# Altium schematic sheet EV9920.SchDoc: CMX992-Based Demodulator
size A2 portrait
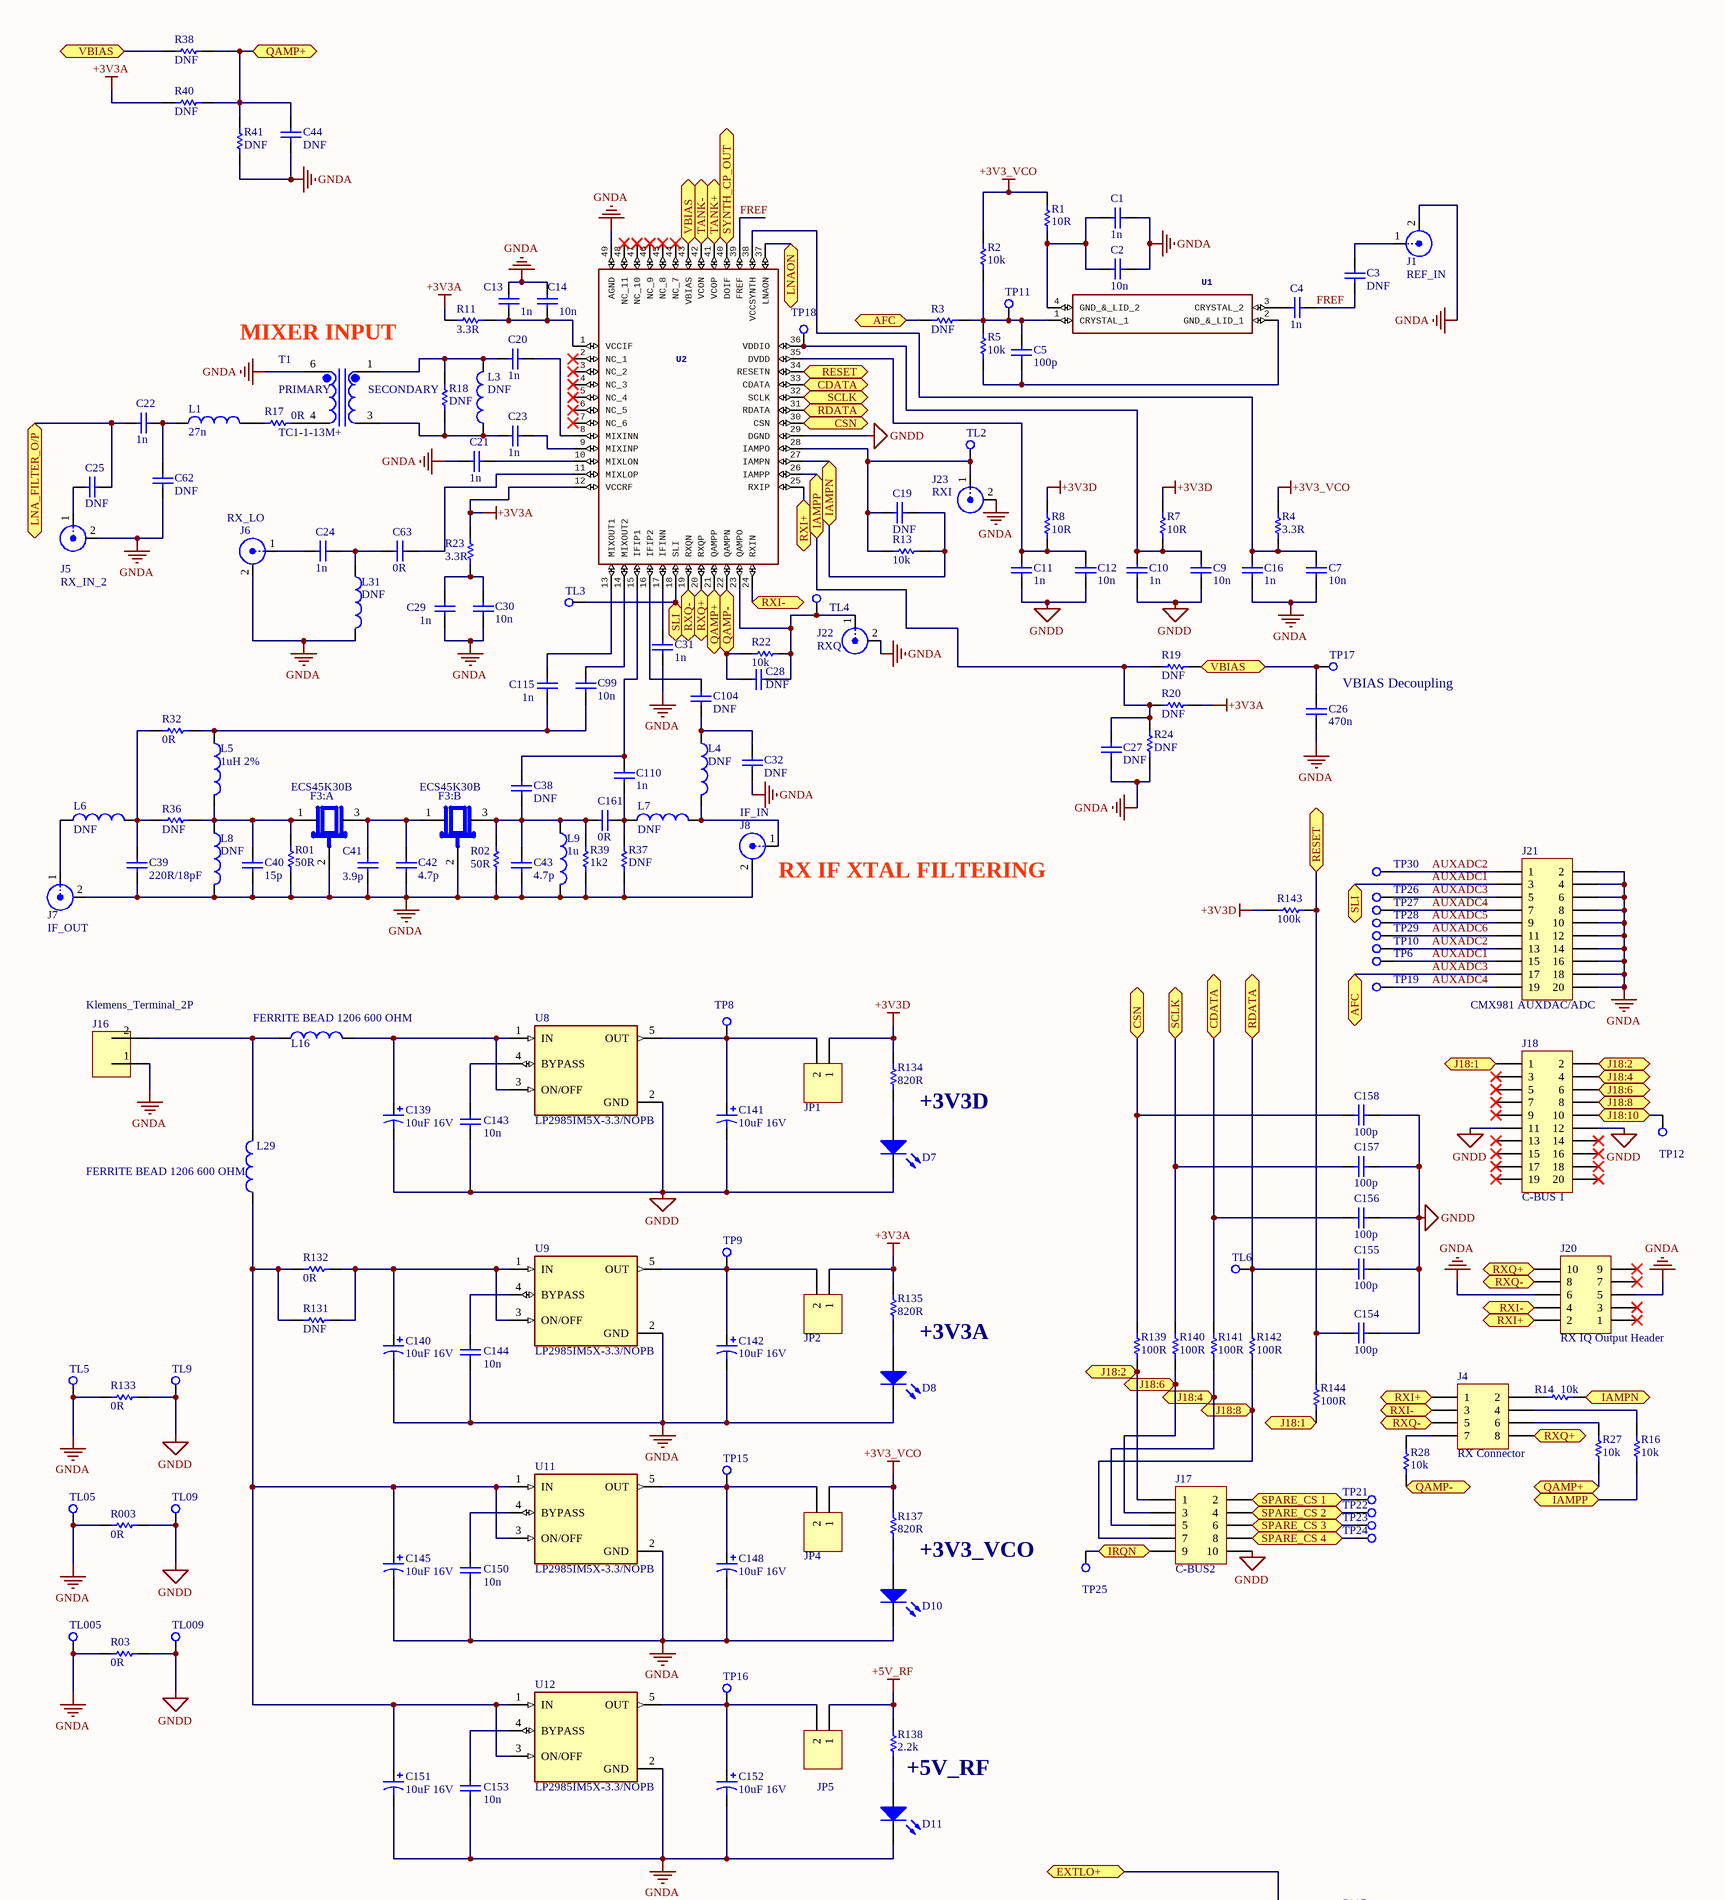
[diagram p0: EV9920.SchDoc, top]
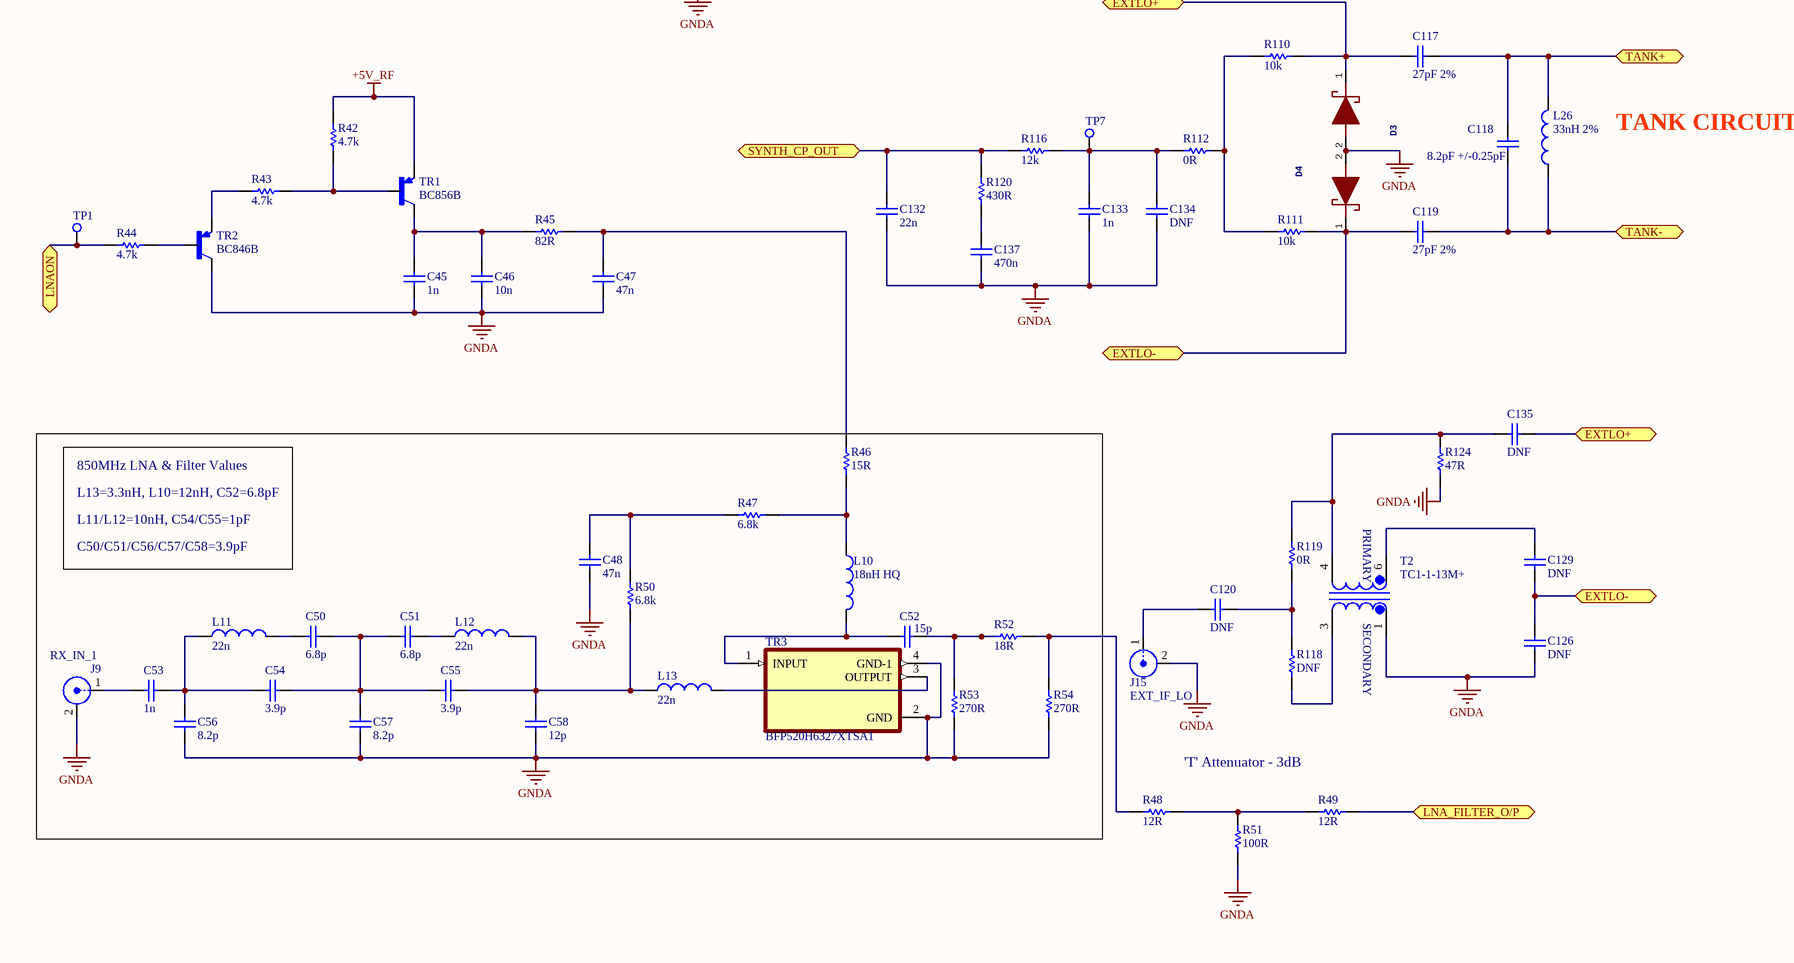
[diagram p1: EV9920.SchDoc, bottom]

## Parts
C1  value 1n  [0805]  (hidden comment: Cap_0805)
C2  value 10n  [0805]  (hidden comment: Cap_0805)
C3  value DNF  [0805]  (hidden comment: Cap_0805)
C4  value 1n  [0805]  (hidden comment: Cap_0805)
C5  value 100p  [0805]  (hidden comment: Cap_0805)
C7  value 10n  [0805]  (hidden comment: Cap_0805)
C9  value 10n  [0805]  (hidden comment: Cap_0805)
C10  value 1n  [0805]  (hidden comment: Cap_0805)
C11  value 1n  [0805]  (hidden comment: Cap_0805)
C12  value 10n  [0805]  (hidden comment: Cap_0805)
C13  value 1n  [0805]  (hidden comment: Cap_0805)
C14  value 10n  [0805]  (hidden comment: Cap_0805)
C16  value 1n  [0805]  (hidden comment: Cap_0805)
C19  value DNF  [0805]  (hidden comment: Cap_0805)
C20  value 1n  [0805]  (hidden comment: Cap_0805)
C21  value 1n  [0805]  (hidden comment: Cap_0805)
C22  value 1n  [0805]  (hidden comment: Cap_0805)
C23  value 1n  [0805]  (hidden comment: Cap_0805)
C24  value 1n  [0805]  (hidden comment: Cap_0805)
C25  value DNF  [0805]  (hidden comment: Cap_0805)
C26  value 470n  [0805]  (hidden comment: Cap_0805)
C27  value DNF  [0805]  (hidden comment: Cap_0805)
C28  value DNF  [0805]  (hidden comment: Cap_0805)
C29  value 1n  [0805]  (hidden comment: Cap_0805)
C30  value 10n  [0805]  (hidden comment: Cap_0805)
C31  value 1n  [0805]  (hidden comment: Cap_0805)
C32  value DNF  [0805]  (hidden comment: Cap_0805)
C38  value DNF  [0805]  (hidden comment: Cap_0805)
C39  value 220R/18pF  [0805]  (hidden comment: Cap_0805)
C40  value 15p  [0805]  (hidden comment: Cap_0805)
C41  value 3.9p  [0805]  (hidden comment: Cap_0805)
C42  value 4.7p  [0805]  (hidden comment: Cap_0805)
C43  value 4.7p  [0805]  (hidden comment: Cap_0805)
C44  value DNF  [0805]  (hidden comment: Cap_0805)
C45  value 1n  [0805]  (hidden comment: Cap_0805)
C46  value 10n  [0805]  (hidden comment: Cap_0805)
C47  value 47n  [0805]  (hidden comment: Cap_0805)
C48  value 47n  [0805]  (hidden comment: Cap_0805)
C50  value 6.8p  [0805]  (hidden comment: Cap_0805)
C51  value 6.8p  [0805]  (hidden comment: Cap_0805)
C52  value 15p  [0805]  (hidden comment: Cap_0805)
C53  value 1n  [0805]  (hidden comment: Cap_0805)
C54  value 3.9p  [0805]  (hidden comment: Cap_0805)
C55  value 3.9p  [0805]  (hidden comment: Cap_0805)
C56  value 8.2p  [0805]  (hidden comment: Cap_0805)
C57  value 8.2p  [0805]  (hidden comment: Cap_0805)
C58  value 12p  [0805]  (hidden comment: Cap_0805)
C62  value DNF  [0805]  (hidden comment: Cap_0805)
C63  value 0R  [0805]  (hidden comment: Cap_0805)
C99  value 10n  [0805]  (hidden comment: Cap_0805)
C104  value DNF  [0805]  (hidden comment: Cap_0805)
C110  value 1n  [0805]  (hidden comment: Cap_0805)
C115  value 1n  [0805]  (hidden comment: Cap_0805)
C117  value 27pF 2%  [0805]  (hidden comment: Cap_0805)
C118  value 8.2pF +/-0.25pF  [0805]  (hidden comment: Cap_0805)
C119  value 27pF 2%  [0805]  (hidden comment: Cap_0805)
C120  value DNF  [0805]  (hidden comment: Cap_0805)
C126  value DNF  [0805]  (hidden comment: Cap_0805)
C129  value DNF  [0805]  (hidden comment: Cap_0805)
C132  value 22n  [0805]  (hidden comment: Cap_0805)
C133  value 1n  [0805]  (hidden comment: Cap_0805)
C134  value DNF  [0805]  (hidden comment: Cap_0805)
C135  value DNF  [0805]  (hidden comment: Cap_0805)
C137  value 470n  [0805]  (hidden comment: Cap_0805)
C139  value 10uF 16V  [0805 - Directional]  (hidden comment: Cap Pol2)
C140  value 10uF 16V  [0805 - Directional]  (hidden comment: Cap Pol2)
C141  value 10uF 16V  [0805 - Directional]  (hidden comment: Cap Pol2)
C142  value 10uF 16V  [0805 - Directional]  (hidden comment: Cap Pol2)
C143  value 10n  [0805]  (hidden comment: Cap_0805)
C144  value 10n  [0805]  (hidden comment: Cap_0805)
C145  value 10uF 16V  [0805 - Directional]  (hidden comment: Cap Pol2)
C148  value 10uF 16V  [0805 - Directional]  (hidden comment: Cap Pol2)
C150  value 10n  [0805]  (hidden comment: Cap_0805)
C151  value 10uF 16V  [0805 - Directional]  (hidden comment: Cap Pol2)
C152  value 10uF 16V  [0805 - Directional]  (hidden comment: Cap Pol2)
C153  value 10n  [0805]  (hidden comment: Cap_0805)
C154  value 100p  [0805]  (hidden comment: Cap_0805)
C155  value 100p  [0805]  (hidden comment: Cap_0805)
C156  value 100p  [0805]  (hidden comment: Cap_0805)
C157  value 100p  [0805]  (hidden comment: Cap_0805)
C158  value 100p  [0805]  (hidden comment: Cap_0805)
C161  value 0R  [0805]  (hidden comment: Cap_0805)
D3  Small Signal Schottky Diode, Single, 20 V, 500 mA, 480 mV, 6 A, 125 C   Source:  Datasheet  [PMEG2005EB115]  (value not drawn)
D4  Small Signal Schottky Diode, Single, 20 V, 500 mA, 480 mV, 6 A, 125 C   Source:  Datasheet  [PMEG2005EB115]  (value not drawn)
D7  LED_805  [0805 - LED]  (value not drawn)
D8  LED_805  [0805 - LED]  (value not drawn)
D10  LED_805  [0805 - LED]  (value not drawn)
D11  LED_805  [0805 - LED]  (value not drawn)
F3:A  ECS45K30B  [XTAL_ECS45K30A]
F3:B  ECS45K30B  [XTAL_ECS45K30A]
J1  REF_IN  [SMA_RA_DIP]
J4  RX Connector  [HDR2X4]
J5  RX_IN_2  [SMA_RA_DIP]
J6  RX_LO  [SMA_RA_DIP]
J7  IF_OUT  [SMA_RA_DIP]
J8  IF_IN  [SMA_RA_DIP]
J9  RX_IN_1  [SMA_RA_DIP]
J15  EXT_IF_LO  [SMA_RA_DIP]
J16  Klemens_Terminal_2P  [Klemens_Terminal_2P]
J17  C-BUS2  [HDR2X5]
J18  C-BUS 1  [HDR2X10]
J20  RX IQ Output Header  [HDR2X5]
J21  CMX981 AUXDAC/ADC  [HDR2X10]
J22  RXQ  [SMA_RA_DIP]
J23  RXI  [SMA_RA_DIP]
JP1  (no value)  [HDR1X2]
JP2  (no value)  [HDR1X2]
JP4  (no value)  [HDR1X2]
JP5  Header 2  [HDR1X2]  (value not drawn)
L1  value 27n  [0805]  (hidden comment: IND_0805)
L3  value DNF  [0805]  (hidden comment: IND_0805)
L4  value DNF  [0805]  (hidden comment: IND_0805)
L5  value 1uH 2%  [0805]  (hidden comment: IND_0805)
L6  value DNF  [0805]  (hidden comment: IND_0805)
L7  value DNF  [0805]  (hidden comment: IND_0805)
L8  value DNF  [0805]  (hidden comment: IND_0805)
L9  value 1u  [0805]  (hidden comment: IND_0805)
L10  value 18nH HQ  [0805]  (hidden comment: IND_0805)
L11  value 22n  [0805]  (hidden comment: IND_0805)
L12  value 22n  [0805]  (hidden comment: IND_0805)
L13  value 22n  [0805]  (hidden comment: IND_0805)
L16  value FERRITE BEAD 1206 600 OHM  [1206]  (hidden comment: IND_1206)
L26  value 33nH 2%  [0805]  (hidden comment: IND_0805)
L29  value FERRITE BEAD 1206 600 OHM  [1206]  (hidden comment: IND_1206)
L31  value DNF  [0805]  (hidden comment: IND_0805)
R1  value 10R  [0805]  (hidden comment: Res_0805)
R01  value 50R  [0805]  (hidden comment: Res_0805)
R2  value 10k  [0805]  (hidden comment: Res_0805)
R02  value 50R  [0805]  (hidden comment: Res_0805)
R3  value DNF  [0805]  (hidden comment: Res_0805)
R003  value 0R  [0805]  (hidden comment: Res_0805)
R03  value 0R  [0805]  (hidden comment: Res_0805)
R4  value 3.3R  [0805]  (hidden comment: Res_0805)
R5  value 10k  [0805]  (hidden comment: Res_0805)
R7  value 10R  [0805]  (hidden comment: Res_0805)
R8  value 10R  [0805]  (hidden comment: Res_0805)
R11  value 3.3R  [0805]  (hidden comment: Res_0805)
R13  value 10k  [0805]  (hidden comment: Res_0805)
R14  value 10k  [0805]  (hidden comment: Res_0805)
R16  value 10k  [0805]  (hidden comment: Res_0805)
R17  value 0R  [0805]  (hidden comment: Res_0805)
R18  value DNF  [0805]  (hidden comment: Res_0805)
R19  value DNF  [0805]  (hidden comment: Res_0805)
R20  value DNF  [0805]  (hidden comment: Res_0805)
R22  value 10k  [0805]  (hidden comment: Res_0805)
R23  value 3.3R  [0805]  (hidden comment: Res_0805)
R24  value DNF  [0805]  (hidden comment: Res_0805)
R27  value 10k  [0805]  (hidden comment: Res_0805)
R28  value 10k  [0805]  (hidden comment: Res_0805)
R32  value 0R  [0805]  (hidden comment: Res_0805)
R36  value DNF  [0805]  (hidden comment: Res_0805)
R37  value DNF  [0805]  (hidden comment: Res_0805)
R38  value DNF  [0805]  (hidden comment: Res_0805)
R39  value 1k2  [0805]  (hidden comment: Res_0805)
R40  value DNF  [0805]  (hidden comment: Res_0805)
R41  value DNF  [0805]  (hidden comment: Res_0805)
R42  value 4.7k  [0805]  (hidden comment: Res_0805)
R43  value 4.7k  [0805]  (hidden comment: Res_0805)
R44  value 4.7k  [0805]  (hidden comment: Res_0805)
R45  value 82R  [0805]  (hidden comment: Res_0805)
R46  value 15R  [0805]  (hidden comment: Res_0805)
R47  value 6.8k  [0805]  (hidden comment: Res_0805)
R48  value 12R  [0805]  (hidden comment: Res_0805)
R49  value 12R  [0805]  (hidden comment: Res_0805)
R50  value 6.8k  [0805]  (hidden comment: Res_0805)
R51  value 100R  [0805]  (hidden comment: Res_0805)
R52  value 18R  [0805]  (hidden comment: Res_0805)
R53  value 270R  [0805]  (hidden comment: Res_0805)
R54  value 270R  [0805]  (hidden comment: Res_0805)
R110  value 10k  [0805]  (hidden comment: Res_0805)
R111  value 10k  [0805]  (hidden comment: Res_0805)
R112  value 0R  [0805]  (hidden comment: Res_0805)
R116  value 12k  [0805]  (hidden comment: Res_0805)
R118  value DNF  [0805]  (hidden comment: Res_0805)
R119  value 0R  [0805]  (hidden comment: Res_0805)
R120  value 430R  [0805]  (hidden comment: Res_0805)
R124  value 47R  [0805]  (hidden comment: Res_0805)
R131  value DNF  [0805]  (hidden comment: Res_0805)
R132  value 0R  [0805]  (hidden comment: Res_0805)
R133  value 0R  [0805]  (hidden comment: Res_0805)
R134  value 820R  [0805]  (hidden comment: Res_0805)
R135  value 820R  [0805]  (hidden comment: Res_0805)
R137  value 820R  [0805]  (hidden comment: Res_0805)
R138  value 2.2k  [0805]  (hidden comment: Res_0805)
R139  value 100R  [0805]  (hidden comment: Res_0805)
R140  value 100R  [0805]  (hidden comment: Res_0805)
R141  value 100R  [0805]  (hidden comment: Res_0805)
R142  value 100R  [0805]  (hidden comment: Res_0805)
R143  value 100k  [0805]  (hidden comment: Res_0805)
R144  value 100R  [0805]  (hidden comment: Res_0805)
T1  TC1-1-13M+  [XFMR_TC1-1-13M+]
T2  TC1-1-13M+  [XFMR_TC1-1-13M+]
TL2  (no value)  [test_point]
TL3  TP_1  [test_point]  (value not drawn)
TL4  test_point  [test_point]  (value not drawn)
TL5  (no value)  [test_point]
TL05  (no value)  [test_point]
TL005  (no value)  [test_point]
TL6  (no value)  [test_point]
TL9  (no value)  [test_point]
TL09  (no value)  [test_point]
TL009  (no value)  [test_point]
TP1  TP_1  [test_point]  (value not drawn)
TP6  TP_1  [test_point]  (value not drawn)
TP7  TP_1  [test_point]  (value not drawn)
TP8  TP_1  [test_point]  (value not drawn)
TP9  TP_1  [test_point]  (value not drawn)
TP10  TP_1  [test_point]  (value not drawn)
TP11  TP_1  [test_point]  (value not drawn)
TP12  TP_1  [test_point]  (value not drawn)
TP15  TP_1  [test_point]  (value not drawn)
TP16  TP_1  [test_point]  (value not drawn)
TP17  TP_1  [test_point]  (value not drawn)
TP18  TP_1  [test_point]  (value not drawn)
TP19  TP_1  [test_point]  (value not drawn)
TP21  TP_1  [test_point]  (value not drawn)
TP22  TP_1  [test_point]  (value not drawn)
TP23  TP_1  [test_point]  (value not drawn)
TP24  TP_1  [test_point]  (value not drawn)
TP25  TP_1  [test_point]  (value not drawn)
TP26  TP_1  [test_point]  (value not drawn)
TP27  TP_1  [test_point]  (value not drawn)
TP28  TP_1  [test_point]  (value not drawn)
TP29  TP_1  [test_point]  (value not drawn)
TP30  TP_1  [test_point]  (value not drawn)
TR1  BC856B  [SOT95P240X120-3N]
TR2  BC846B  [SOT95P240X120-3N]
TR3  BFP520H6327XTSA1  [INFINEON_BFP540]
U1  Crystals WE-XTAL 14.74560MHz 30ppm 5.0 x 3.2mm   Source:  Datasheet  [830072403]  (value not drawn)
U2  RF Receiver High Performance 100MHz-1GHz RF Receiver   Source:  Datasheet  [QFN50P700X700X100-49N]  (value not drawn)
U8  LP2985IM5X-3.3/NOPB  [SOT95P280X145-5N]
U9  LP2985IM5X-3.3/NOPB  [SOT95P280X145-5N]
U11  LP2985IM5X-3.3/NOPB  [SOT95P280X145-5N]
U12  LP2985IM5X-3.3/NOPB  [SOT95P280X145-5N]

## Ports
AFC (bidir), CDATA (bidir), CSN (bidir), EXTLO+ (bidir), EXTLO- (bidir), IAMPN (bidir), IAMPP (bidir), IRQN (bidir), J18:1 (bidir), J18:2 (bidir), J18:4 (bidir), J18:6 (bidir), J18:8 (bidir), J18:10 (bidir), LNA_FILTER_O/P, LNA_FILTER_O/P (bidir), LNAON (bidir), QAMP+ (bidir), QAMP- (bidir), RDATA (bidir), RESET (bidir), RXI+ (bidir), RXI- (bidir), RXQ+ (bidir), RXQ- (bidir), SCLK (bidir), SLI (bidir), SPARE_CS 1 (bidir), SPARE_CS 2 (bidir), SPARE_CS 3 (bidir), SPARE_CS 4 (bidir), SYNTH_CP_OUT (bidir), TANK+ (bidir), TANK- (bidir), VBIAS (bidir)

## Nets
+3V3_VCO: JP4.1 R1.1 R2.1 R4.1 R137.1
+3V3A: JP2.1 R11.1 R20.1 R23.2 R40.2 R135.1 U2.12(VCCRF)
+3V3D: JP1.1 R7.1 R8.1 R134.1 R143.2
+5V_RF: JP5.1 R42.2 R138.1 TR1.2(E)
GNDA: C1.2 C2.2 C7.1 C13.2 C14.2 C16.1 C21.1 C26.2 C27.2 C29.1 C30.1 C31.1 C32.1 C39.2 C40.2 C41.2 C42.2 C43.2 C44.1 C45.1 C46.1 C47.1 C48.1 C56.1 C57.1 C58.1 C62.1 C126.1 C132.1 C133.1 C134.1 C137.1 C140.2 C142.2 C144.1 C145.2 C148.2 C150.1 C151.2 C152.2 C153.1 D3.2(A) D4.2(A) D8.2(K) D10.2(K) D11.2(K) F3:A.2(GND) F3:B.2(GND) J1.2(Y) J5.2(Y) J6.2(Y) J7.2(Y) J8.2(Y) J9.2(Y) J15.2(Y) J16.1 J20.5 J20.6 J21.2 J21.4 J21.6 J21.8 J21.10 J21.12 J21.14 J21.16 J21.18 J21.20 J22.2(Y) J23.2(Y) L8.2 L9.2 L31.2 R01.1 R02.1 R003.1 R03.1 R24.1 R37.1 R39.1 R41.2 R51.1 R53.1 R54.1 R124.1 R133.1 T1.6 T2.1 TL5.1 TL05.1 TL005.1 TR2.3(C) TR3.2(GND) TR3.4(GND-1) U2.49(AGND) U9.2(GND) U11.2(GND) U12.2(GND)
GNDD: C9.1 C10.1 C11.1 C12.1 C139.2 C141.2 C143.1 C154.1 C155.1 C156.1 C157.1 C158.1 D7.2(K) J17.10 J18.11 J18.12 R003.2 R03.2 R133.2 TL9.1 TL09.1 TL009.1 U2.29(DGND) U8.2(GND)
AUXADC1: J21.3 J21.15 TL3.1 TP6.1 U2.18(SLI) ; port SLI
AUXADC2: J21.1 J21.13 TP10.1 TP30.1
AUXADC3: J21.5 J21.17 R3.1 TP26.1 ; port AFC
AUXADC4: J21.7 J21.19 TP19.1 TP27.1
AUXADC5: J21.9 TP28.1
AUXADC6: J21.11 TP29.1
CDATA: C156.2 R141.2 U2.33(CDATA) ; port CDATA
CSN: C158.2 R139.2 U2.30(CSN) ; port CSN
EXTLO+: C117.2 C135.2 D3.1(K) R110.1 ; port EXTLO+
EXTLO-: C119.2 C126.2 C129.1 D4.1(K) R111.1 ; port EXTLO-
FREF: C3.2 C4.1 U2.39(FREF)
IAMPN: C19.1 R13.1 R14.1 U2.27(IAMPN) ; port IAMPN
IAMPP: C27.1 R16.2 R19.2 R20.2 R24.2 U2.26(IAMPP) ; port IAMPP
IRQN: J17.9 TP25.1 ; port IRQN
J18:1: J18.1 R144.1 ; port J18:1
J18:2: J17.1 J18.2 R139.1 ; port J18:2
J18:4: J17.5 J18.4 R141.1 ; port J18:4
J18:6: J17.3 J18.6 R140.1 ; port J18:6
J18:8: J17.7 J18.8 R142.1 ; port J18:8
J18:10: J18.10 TP12.1 ; port J18:10
LNA_FILTER_O/P: C22.1 C25.1 R49.1 ; port LNA_FILTER_O/P
LNAON: R44.1 TP1.1 U2.37(LNAON) ; port LNAON
QAMP+: C44.2 R27.1 R38.1 R40.1 R41.1 U2.21(QAMPP) ; port QAMP+
QAMP-: C28.2 R22.2 R28.1 U2.22(QAMPN) ; port QAMP-
RDATA: C155.2 R142.2 TL6.1 U2.31(RDATA) ; port RDATA
RESET: C154.2 R143.1 R144.2 U2.34(RESETN) ; port RESET
RXI+: J4.1 J20.2 U2.25(RXIP) ; port RXI+
RXI-: J4.3 J20.4 U2.24(RXIN) ; port RXI-
RXQ+: J4.8 J20.10 U2.20(RXQP) ; port RXQ+
RXQ-: J4.5 J20.8 U2.19(RXQN) ; port RXQ-
SCLK: C157.2 R140.2 U2.32(SCLK) ; port SCLK
SPARE_CS 1: J17.2 TP21.1 ; port SPARE_CS 1
SPARE_CS 2: J17.4 TP22.1 ; port SPARE_CS 2
SPARE_CS 3: J17.6 TP23.1 ; port SPARE_CS 3
SPARE_CS 4: J17.8 TP24.1 ; port SPARE_CS 4
SYNTH_CP_OUT: C132.2 R116.2 R120.1 U2.40(DOIF) ; port SYNTH_CP_OUT
TANK+: C117.1 C118.2 L26.2 U2.41(VCOP) ; port TANK+
TANK-: C118.1 C119.1 L26.1 U2.42(VCON) ; port TANK-
VBIAS: C26.1 R19.1 R38.2 TP17.1 U2.43(VBIAS) ; port VBIAS
NetC1_1: C1.1 C2.1 R1.2 U1.4(GND_&_LID_2)
NetC3_1: C3.1 J1.1(X)
NetC4_2: C4.2 U1.3(CRYSTAL_2)
NetC5_1: C5.1 R2.2 R3.2 R5.1 TP11.1 U1.1(CRYSTAL_1)
NetC5_2: C5.2 R5.2 U1.2(GND_&_LID_1)
NetC7_2: C7.2 C16.2 R4.2 U2.38(VCCSYNTH)
NetC9_2: C9.2 C10.2 R7.2 TP18.1 U2.36(VDDIO)
NetC11_2: C11.2 C12.2 R8.2 U2.35(DVDD)
NetC13_1: C13.1 C14.1 R11.2 U2.1(VCCIF)
NetC19_2: C19.2 J23.1(X) R13.2 TL2.1 U2.28(IAMPO)
NetC20_1: C20.1 L3.2 R18.2 T1.1
NetC20_2: C20.2 U2.8(MIXINN)
NetC21_2: C21.2 U2.10(MIXLON)
NetC22_2: C22.2 C62.2 L1.1
NetC23_1: C23.1 L3.1 R18.1 T1.3
NetC23_2: C23.2 U2.9(MIXINP)
NetC24_1: C24.1 C63.1 L31.1
NetC24_2: C24.2 J6.1(X)
NetC25_2: C25.2 J5.1(X)
NetC28_1: C28.1 J22.1(X) R22.1 TL4.1 U2.23(QAMPO)
NetC29_2: C29.2 C30.2 R23.1
NetC31_2: C31.2 U2.17(IFINN)
NetC32_2: C32.2 C104.1 L4.1
NetC38_1: C38.1 C110.2 U2.15(IFIP1)
NetC38_2: C38.2 C43.1 C161.2 F3:B.3 L9.1 R02.2 R39.2
NetC39_1: C39.1 L6.2 R32.2 R36.2
NetC40_1: C40.1 F3:A.1 L5.2 L8.1 R01.2 R36.1
NetC41_1: C41.1 C42.1 F3:A.3 F3:B.1
NetC45_2: C45.2 C46.2 R45.1 TR1.3(C)
NetC47_2: C47.2 R45.2 R46.2
NetC48_2: C48.2 R47.2 R50.2
NetC50_1: C50.1 L11.2
NetC50_2: C50.2 C51.1 C54.2 C55.1 C57.2
NetC51_2: C51.2 L12.1
NetC52_1: C52.1 R52.2 R53.2
NetC52_2: C52.2 L10.2 TR3.1(INPUT)
NetC53_1: C53.1 J9.1(X)
NetC53_2: C53.2 C54.1 C56.2 L11.1
NetC55_2: C55.2 C58.2 L12.2 L13.1 R50.1
NetC63_2: C63.2 U2.11(MIXLOP)
NetC99_1: C99.1 C115.1 L5.1 R32.1
NetC99_2: C99.2 U2.14(MIXOUT2)
NetC104_2: C104.2 U2.16(IFIP2)
NetC110_1: C110.1 C161.1 L7.1 R37.2
NetC115_2: C115.2 U2.13(MIXOUT1)
NetC120_1: C120.1 J15.1(X)
NetC120_2: C120.2 R118.2 R119.1
NetC129_2: C129.2 T2.6
NetC133_2: C133.2 C134.2 R112.2 R116.1 TP7.1
NetC135_1: C135.1 R119.2 R124.2 T2.4
NetC137_2: C137.2 R120.2
NetC139_1: C139.1 L16.2 U8.1(IN) U8.3(ON/OFF)
NetC140_1: C140.1 R131.2 R132.2 U9.1(IN) U9.3(ON/OFF)
NetC141_1: C141.1 JP1.2 TP8.1 U8.5(OUT)
NetC142_1: C142.1 JP2.2 TP9.1 U9.5(OUT)
NetC143_2: C143.2 U8.4(BYPASS)
NetC144_2: C144.2 U9.4(BYPASS)
NetC145_1: C145.1 C151.1 L29.1 R131.1 R132.1 U11.1(IN) U11.3(ON/OFF) U12.1(IN) U12.3(ON/OFF)
NetC148_1: C148.1 JP4.2 TP15.1 U11.5(OUT)
NetC150_2: C150.2 U11.4(BYPASS)
NetC152_1: C152.1 JP5.2 TP16.1 U12.5(OUT)
NetC153_2: C153.2 U12.4(BYPASS)
NetD7_1: D7.1(A) R134.2
NetD8_1: D8.1(A) R135.2
NetD10_1: D10.1(A) R137.2
NetD11_1: D11.1(A) R138.2
NetJ4_2: J4.2 R14.2
NetJ4_4: J4.4 R16.1
NetJ4_6: J4.6 R27.2
NetJ4_7: J4.7 R28.2
NetJ7_1: J7.1(X) L6.1
NetJ8_1: J8.1(X) L4.2 L7.2
NetJ16_2: J16.2 L16.1 L29.2
NetL1_2: L1.2 R17.2
NetL10_1: L10.1 R46.1 R47.1
NetL13_2: L13.2 TR3.3(OUTPUT)
NetR17_1: R17.1 T1.4
NetR42_1: R42.1 R43.2 TR1.1(B)
NetR43_1: R43.1 TR2.2(E)
NetR44_2: R44.2 TR2.1(B)
NetR48_1: R48.1 R52.1 R54.2
NetR48_2: R48.2 R49.2 R51.2
NetR110_2: R110.2 R111.2 R112.1
NetR118_1: R118.1 T2.3

Not connected (* = marked no-connect by the designer): J18 3* 5* 7* 9* 13* 14* 15* 16* 17* 18* 19* 20*; J20 1* 3* 7* 9*; U2 2(NC_1)* 3(NC_2)* 4(NC_3)* 5(NC_4)* 6(NC_5)* 7(NC_6)* 44(NC_7)* 45(NC_8)* 46(NC_9)* 47(NC_10)* 48(NC_11)*

## Notes on the sheet
- (near T1) MIXER INPUT
- (near TP17) VBIAS Decoupling
- (near J8) RX IF XTAL FILTERING
- +3V3D
- +3V3A
- +3V3_VCO
- (near R138) +5V_RF
- TANK CIRCUIT
- 850MHz LNA & Filter Values
- L13=3.3nH, L10=12nH, C52=6.8pF
- L11/L12=10nH, C54/C55=1pF
- C50/C51/C56/C57/C58=3.9pF
- 'T' Attenuator - 3dB
- Title
- Size:
- Date:
- File:
- A2
- Number:
- Time:
- Revision:
- Sheet
- of
- (in symbol TC1-1-13M+) PRIMARY; SECONDARY

## Library data of the parts
C1-C5 C7 C9-C14 C16 C19-C32 C38-C48 C50-C58 C62 C63 C99 C104 C110 C115 C117-C120 C126 C129 C132-C135 C137 C143 C144 C150 C153-C158 C161 = Cap_0805: ABE_Capacitor; Ozdisan Link: *; Ozdisan P/N: *; DigiKey P/N: *; DigiKey Link: *; Package: 0805
C139-C142 C145 C148 C151 C152 = Cap_0805_Directional: ABE_Capacitor_Directional; Ozdisan Link: *; Ozdisan P/N: *; DigiKey P/N: *; DigiKey Link: *; Package: 0805
D3 D4 = PMEG2005EB,115: Manufacturer_Name: Nexperia; GateName_1: G$1; SymbolName_1: PMEG2005EB,115; LibraryName: PMEG2005EB_115; DeviceSetName: PMEG2005EB,115; Mouser_Part_Number: 771-PMEG2005EBT/R; Mouser_Price-Stock: https://www.mouser.co.uk/ProductDetail/Nexperia/PMEG2005EB115?qs=LOCUfHb8d9sW3PDwXGb8gA%3D%3D; Manufacturer_Part_Number: PMEG2005EB,115; Height: 0.65mm
D7 D8 D10 D11 = LED_805: ABE_LED
F3:A F3:B = ECS45K30A: 45 MHz Center 1.2 kOhms Monolithic Crystal Filter Through Hole 2dB 15 kHz; MF: ECS International; SnapEDA_Link: https://www.snapeda.com/parts/ECS45K30A/ECS+Inc./view-part/?ref=snap; Package: NON-STANDARD-3 ECS; Value: *; MP: ECS45K30A; Check_prices: https://www.snapeda.com/parts/ECS45K30A/ECS+Inc./view-part/?ref=eda
J1 J5-J9 J15 J22 J23 = SMA Right Angle Connector
J4 = Header 4X2: Header, 4-Pin, Dual row; LatestRevisionDate: 17-Jul-2002; LatestRevisionNote: Re-released for DXP Platform.; Publisher: Altium Limited
J17 J20 = Header 5X2: Header, 5-Pin, Dual row; LatestRevisionDate: 17-Jul-2002; LatestRevisionNote: Re-released for DXP Platform.; Publisher: Altium Limited
J18 J21 = Header 10X2: Header, 10-Pin, Dual row; LatestRevisionDate: 17-Jul-2002; LatestRevisionNote: Re-released for DXP Platform.; Publisher: Altium Limited
JP1 JP2 JP4 JP5 = Header 2: Header, 2-Pin; LatestRevisionDate: 17-Jul-2002; LatestRevisionNote: Re-released for DXP Platform.; Publisher: Altium Limited
L1 L3-L13 L26 L31 = IND_0805: ABE_Inductor; Ozdisan Link: *; Ozdisan P/N: *; DigiKey P/N: *; DigiKey Link: *; Package: 0805
L16 L29 = IND_1206: ABE_Inductor; Ozdisan Link: *; Ozdisan P/N: *; DigiKey P/N: *; DigiKey Link: *; Package: 1206
R1 R01 R2 R02 R3 R003 R03-R5 R7 R8 R11 R13 R14 R16-R20 R22-R24 R27 R28 R32 R36-R54 R110-R112 R116 R118-R120 R124 R131-R135 R137-R144 = Res_0805: ABE_Resistor; Ozdisan Link: *; Ozdisan P/N: *; DigiKey P/N: *; DigiKey Link: *; Package: 0805
T1 T2 = TC1-1-13M+: Transformer; MF: Mini-Circuits; Price: None; Package: None; SnapEDA_Link: https://www.snapeda.com/parts/TC1-1-13M%2B/Mini-Circuits/view-part/105812/?ref=snap; Value: *; MP: TC1-1-13M+; Availability: Unavailable
TL2 TL3 TL5 TL05 TL005 TL6 TL9 TL09 TL009 TP1 TP6-TP12 TP15-TP19 TP21-TP30 = test_point: Testpoint1: *
TR1 TR2 = BC856B: MF: {'manufacturer': u'Diotec Semiconductor'}; Package: None; Price: None; Value: *; MP: BC856B; Availability: Unavailable
TR3 = BFP520H6327XTSA1: NPN Silicon RF Transistor; MF: Infineon Technologies; SnapEDA_Link: https://www.snapeda.com/parts/BFP520H6327XTSA1/Infineon+Technologies/view-part/?ref=snap; Package: SOT-343 Infineon; Value: *; MP: BFP520H6327XTSA1; Check_prices: https://www.snapeda.com/parts/BFP520H6327XTSA1/Infineon+Technologies/view-part/?ref=eda
U1 = 830072403: Manufacturer_Name: Wurth Elektronik; GateName_1: G$1; SymbolName_1: 830072403; LibraryName: 830072403; DeviceSetName: 830072403; Manufacturer_Part_Number: 830072403; Height: 1mm
U2 = CMX992Q3: Manufacturer_Name: CML Micro; GateName_1: G$1; SymbolName_1: CMX992Q3; LibraryName: CMX992Q3; DeviceSetName: CMX992Q3; Manufacturer_Part_Number: CMX992Q3; Height: 1mm
U8 U9 U11 U12 = LP2985IM5X-3.3/NOPB: 150-mA, 16-V, low-dropout voltage regulator with enable 5-SOT-23 -40 to 125; Value: *; Availability: Unavailable; Package: None; MP: LP2985IM5X-3.3/NOPB; Price: None
TL4 = test_point: Testpoint1: *